# Altium project pinout_board_ver1.PrjPcb
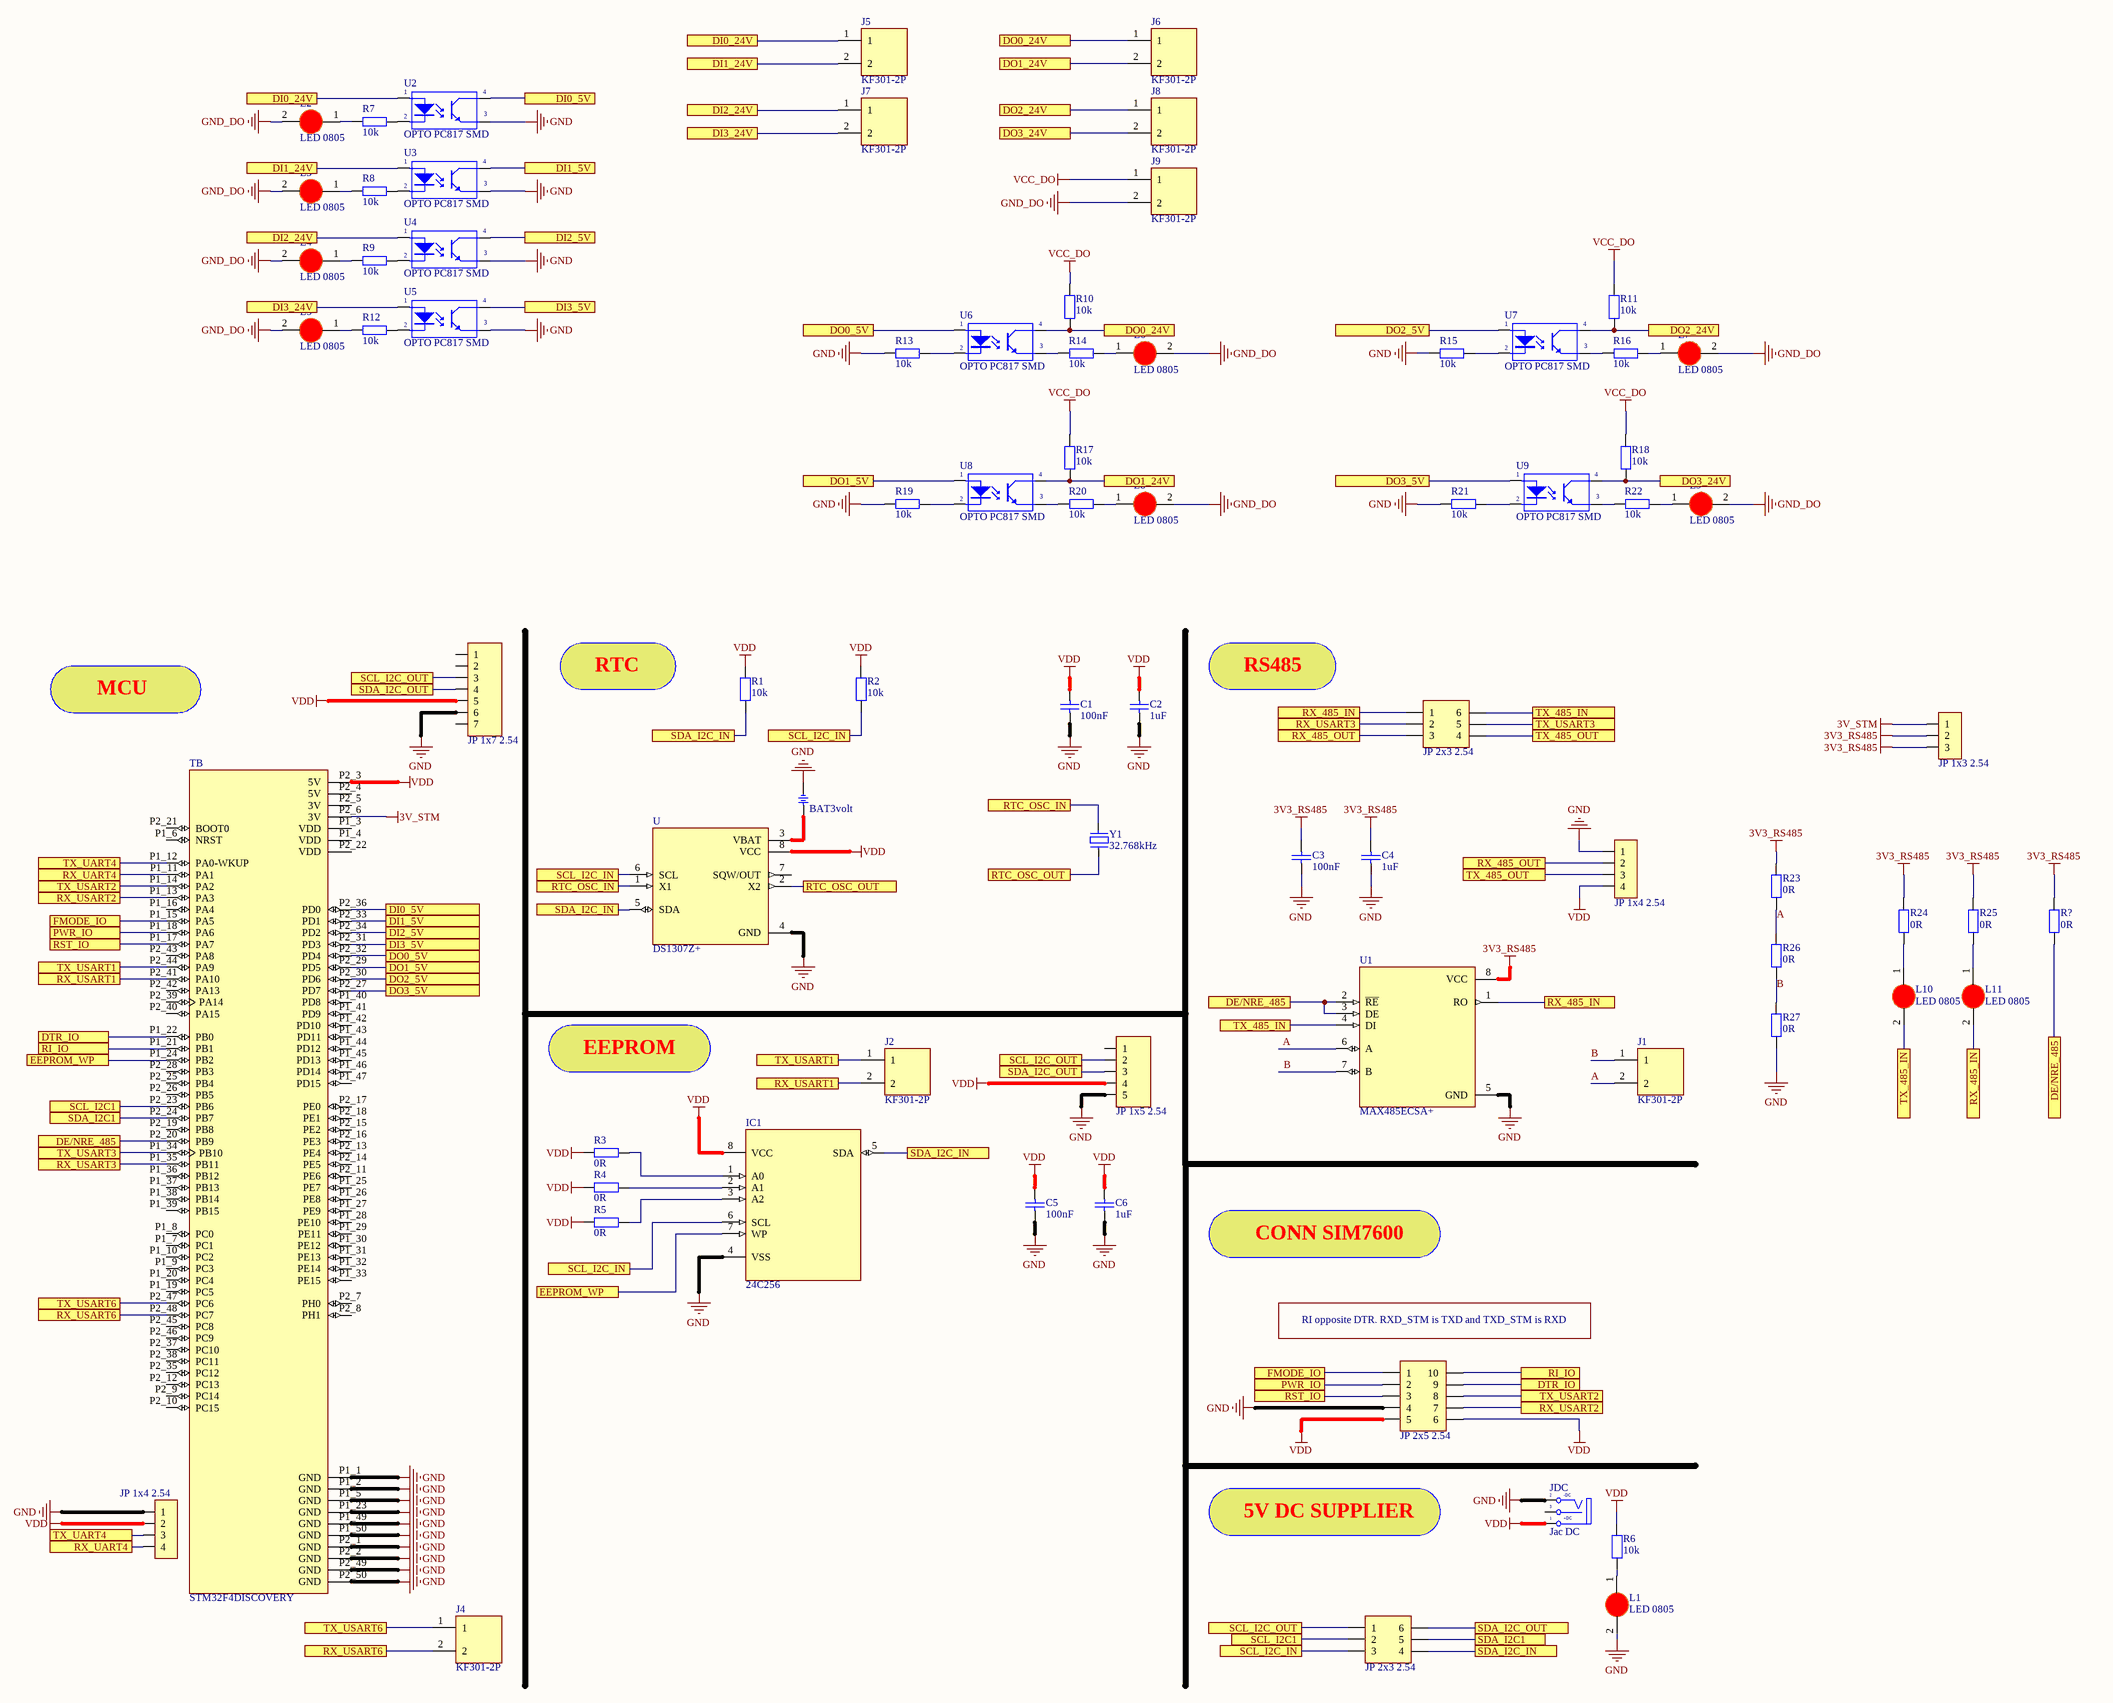
[diagram p0: Sch_pinout_board.SchDoc]
1 sheet, 76 parts. Net scope: flat (ports and power ports of the same name join across sheets).
Board file: PCB_pinout_board.PcbDoc

## Sheet Sch_pinout_board.SchDoc
size C; Organization: Altium Limited; Address1: L3, 12a Rodborough Rd; Address2: Frenchs Forest; Address3: NSW; Address4: Australia 2086

### Parts
BT1  BAT3volt  [BTH2032]
C1  100nF  [tu 0805]
C2  1uF  [tu 0805]
C3  100nF  [tu 0805]
C4  1uF  [tu 0805]
C5  100nF  [tu 0805]
C6  1uF  [tu 0805]
IC1  24C256  [SOIC127P600X175-8N]
J1  KF301-2P  [HANDSON_KF301-2P]
J2  KF301-2P  [HANDSON_KF301-2P]
J4  KF301-2P  [HANDSON_KF301-2P]
J5  KF301-2P  [HANDSON_KF301-2P]
J6  KF301-2P  [HANDSON_KF301-2P]
J7  KF301-2P  [HANDSON_KF301-2P]
J8  KF301-2P  [HANDSON_KF301-2P]
J9  KF301-2P  [HANDSON_KF301-2P]
JDC  Jac DC  [DC-IN]
JP1  JP 2x3 2.54  [JP 2x3 DT]
JP2  JP 1x4 2.54  [JP 1x4 CT]
JP3  JP 2x5 2.54  [JP 2x5 CT]
JP4  JP 1x7 2.54  [JP 1x7 CT]
JP5  JP 1x5 2.54  [JP 1x5 CT]
JP6  JP 2x3 2.54  [JP 2x3 DT]
JP50  JP 1x4 2.54  [JP 1x4 DT]
JP?  JP 1x3 2.54  [JP 1x3 DT]
L1  LED 0805  [LED-0805-Red]
L2  LED 0805  [LED-0805-Red]
L3  LED 0805  [LED-0805-Red]
L4  LED 0805  [LED-0805-Red]
L5  LED 0805  [LED-0805-Red]
L6  LED 0805  [LED-0805-Red]
L7  LED 0805  [LED-0805-Red]
L8  LED 0805  [LED-0805-Red]
L9  LED 0805  [LED-0805-Red]
L10  LED 0805  [LED-0805-Red]
L11  LED 0805  [LED-0805-Red]
R1  10k  [tro smd 0805]
R2  10k  [tro smd 0805]
R3  0R  [tro smd 0805]
R4  0R  [tro smd 0805]
R5  0R  [tro smd 0805]
R6  10k  [tro smd 0805]
R7  10k  [tro smd 0805]
R8  10k  [tro smd 0805]
R9  10k  [tro smd 0805]
R10  10k  [tro smd 0805]
R11  10k  [tro smd 0805]
R12  10k  [tro smd 0805]
R13  10k  [tro smd 0805]
R14  10k  [tro smd 0805]
R15  10k  [tro smd 0805]
R16  10k  [tro smd 0805]
R17  10k  [tro smd 0805]
R18  10k  [tro smd 0805]
R19  10k  [tro smd 0805]
R20  10k  [tro smd 0805]
R21  10k  [tro smd 0805]
R22  10k  [tro smd 0805]
R23  0R  [tro smd 0805]
R24  0R  [tro smd 0805]
R25  0R  [tro smd 0805]
R26  0R  [tro smd 0805]
R27  0R  [tro smd 0805]
R?  0R  [tro smd 0805]
TB  STM32F4DISCOVERY  [MODULE_STM32F4DISCOVERY]
U  DS1307Z+  [SOIC127P600X175-8N]
U1  MAX485ECSA+  [SOIC127P600X175-8N]
U2  OPTO PC817 SMD  [SOP4]
U3  OPTO PC817 SMD  [SOP4]
U4  OPTO PC817 SMD  [SOP4]
U5  OPTO PC817 SMD  [SOP4]
U6  OPTO PC817 SMD  [SOP4]
U7  OPTO PC817 SMD  [SOP4]
U8  OPTO PC817 SMD  [SOP4]
U9  OPTO PC817 SMD  [SOP4]
Y1  32.768kHz  [Thach Anh 2 Chan 32,768 KHz]

### Ports
DE/NRE_485, DI0_5V, DI0_24V, DI1_5V, DI1_24V, DI2_5V, DI2_24V, DI3_5V, DI3_24V, DO0_5V, DO0_24V, DO1_5V, DO1_24V, DO2_5V, DO2_24V, DO3_5V, DO3_24V, DTR_IO, EEPROM_WP, FMODE_IO, PWR_IO, RI_IO, RST_IO, RTC_OSC_IN, RTC_OSC_OUT, RX_485_IN, RX_485_OUT, RX_UART4, RX_USART1, RX_USART2, RX_USART3, RX_USART6, SCL_I2C1, SCL_I2C_IN, SCL_I2C_OUT, SDA_I2C1, SDA_I2C_IN, SDA_I2C_OUT, TX_485_IN, TX_485_OUT, TX_UART4, TX_USART1, TX_USART2, TX_USART3, TX_USART6

### Nets
3V3_RS485: C3.1 C4.1 JP?.2 JP?.3 R23.2 R24.2 R25.2 R?.2 U1.8(VCC)
3V_STM: JP?.1 TB.P2_6(3V)
GND: BT1.2 C1.2 C2.2 C3.2 C4.2 C5.2 C6.2 IC1.4(VSS) JDC.2(TN) JP2.1 JP3.4 JP4.6 JP5.5 JP50.1 L1.2(K) R13.1 R15.1 R19.1 R21.1 R27.1 TB.P1_1(GND) TB.P1_2(GND) TB.P1_5(GND) TB.P1_23(GND) TB.P1_49(GND) TB.P1_50(GND) TB.P2_1(GND) TB.P2_2(GND) TB.P2_49(GND) TB.P2_50(GND) U.4(GND) U1.5(GND) U2.3(E) U3.3(E) U4.3(E) U5.3(E)
GND_DO: J9.2 L2.2(K) L3.2(K) L4.2(K) L5.2(K) L6.2(K) L7.2(K) L8.2(K) L9.2(K)
VCC_DO: J9.1 R10.2 R11.2 R17.2 R18.2
VDD: C1.1 C2.1 C5.1 C6.1 IC1.8(VCC) JDC.1(T) JP2.4 JP3.5 JP3.6 JP4.5 JP5.4 JP50.2 R1.1 R2.1 R3.1 R4.1 R5.1 R6.1 TB.P2_3(5V) U.8(VCC)
A: J1.2 R23.1 R26.2 U1.6(A)
B: J1.1 R26.1 R27.2 U1.7(B)
NetBT1_1: BT1.1 U.3(VBAT)
NetIC1_1: IC1.1(A0) R3.2
NetIC1_2: IC1.2(A1) R4.2
NetIC1_3: IC1.3(A2) R5.2
NetIC1_5: IC1.5(SDA) JP6.4 R1.2 U.5(SDA) ; port SDA_I2C_IN
NetIC1_6: IC1.6(SCL) JP6.3 R2.2 U.6(SCL) ; port SCL_I2C_IN
NetIC1_7: IC1.7(WP) TB.P1_24(PB2) ; port EEPROM_WP
NetJ2_1: J2.1 TB.P2_44(PA9) ; port TX_USART1
NetJ2_2: J2.2 TB.P2_41(PA10) ; port RX_USART1
NetJ4_1: J4.1 TB.P2_47(PC6) ; port TX_USART6
NetJ4_2: J4.2 TB.P2_48(PC7) ; port RX_USART6
NetJ5_1: J5.1 U2.1(A) ; port DI0_24V
NetJ5_2: J5.2 U3.1(A) ; port DI1_24V
NetJ6_1: J6.1 R10.1 U6.4(C) ; port DO0_24V
NetJ6_2: J6.2 R17.1 U8.4(C) ; port DO1_24V
NetJ7_1: J7.1 U4.1(A) ; port DI2_24V
NetJ7_2: J7.2 U5.1(A) ; port DI3_24V
NetJ8_1: J8.1 R11.1 U7.4(C) ; port DO2_24V
NetJ8_2: J8.2 R18.1 U9.4(C) ; port DO3_24V
NetJP1_1: JP1.1 L11.2(K) U1.1(RO) ; port RX_485_IN
NetJP1_2: JP1.2 TB.P1_35(PB11) ; port RX_USART3
NetJP1_3: JP1.3 JP2.2 ; port RX_485_OUT
NetJP1_4: JP1.4 JP2.3 ; port TX_485_OUT
NetJP1_5: JP1.5 TB.P1_34(PB10) ; port TX_USART3
NetJP1_6: JP1.6 L10.2(K) U1.4(DI) ; port TX_485_IN
NetJP3_1: JP3.1 TB.P1_15(PA5) ; port FMODE_IO
NetJP3_2: JP3.2 TB.P1_18(PA6) ; port PWR_IO
NetJP3_3: JP3.3 TB.P1_17(PA7) ; port RST_IO
NetJP3_7: JP3.7 TB.P1_13(PA3) ; port RX_USART2
NetJP3_8: JP3.8 TB.P1_14(PA2) ; port TX_USART2
NetJP3_9: JP3.9 TB.P1_22(PB0) ; port DTR_IO
NetJP3_10: JP3.10 TB.P1_21(PB1) ; port RI_IO
NetJP4_3: JP4.3 JP5.2 JP6.1 ; port SCL_I2C_OUT
NetJP4_4: JP4.4 JP5.3 JP6.6 ; port SDA_I2C_OUT
NetJP6_2: JP6.2 TB.P2_23(PB6) ; port SCL_I2C1
NetJP6_5: JP6.5 TB.P2_24(PB7) ; port SDA_I2C1
NetJP50_3: JP50.3 TB.P1_12(PA0-WKUP) ; port TX_UART4
NetJP50_4: JP50.4 TB.P1_11(PA1) ; port RX_UART4
NetL1_1: L1.1(A) R6.2
NetL2_1: L2.1(A) R7.1
NetL3_1: L3.1(A) R8.1
NetL4_1: L4.1(A) R9.1
NetL5_1: L5.1(A) R12.2
NetL6_1: L6.1(A) R14.2
NetL7_1: L7.1(A) R16.2
NetL8_1: L8.1(A) R20.2
NetL9_1: L9.1(A) R22.2
NetL10_1: L10.1(A) R24.1
NetL11_1: L11.1(A) R25.1
NetR7_2: R7.2 U2.2(K)
NetR8_2: R8.2 U3.2(K)
NetR9_2: R9.2 U4.2(K)
NetR12_1: R12.1 U5.2(K)
NetR13_2: R13.2 U6.2(K)
NetR14_1: R14.1 U6.3(E)
NetR15_2: R15.2 U7.2(K)
NetR16_1: R16.1 U7.3(E)
NetR19_2: R19.2 U8.2(K)
NetR20_1: R20.1 U8.3(E)
NetR21_2: R21.2 U9.2(K)
NetR22_1: R22.1 U9.3(E)
NetR?_1: R?.1 TB.P2_20(PB9) U1.2(~{RE}) U1.3(DE) ; port DE/NRE_485
NetTB_P2_27: TB.P2_27(PD7) U9.1(A) ; port DO3_5V
NetTB_P2_29: TB.P2_29(PD5) U8.1(A) ; port DO1_5V
NetTB_P2_30: TB.P2_30(PD6) U7.1(A) ; port DO2_5V
NetTB_P2_31: TB.P2_31(PD3) U5.4(C) ; port DI3_5V
NetTB_P2_32: TB.P2_32(PD4) U6.1(A) ; port DO0_5V
NetTB_P2_33: TB.P2_33(PD1) U3.4(C) ; port DI1_5V
NetTB_P2_34: TB.P2_34(PD2) U4.4(C) ; port DI2_5V
NetTB_P2_36: TB.P2_36(PD0) U2.4(C) ; port DI0_5V
NetU_1: U.1(X1) Y1.2 ; port RTC_OSC_IN
NetU_2: U.2(X2) Y1.1 ; port RTC_OSC_OUT

Not connected (* = marked no-connect by the designer): JDC 3(S); JP4 1 2 7; JP5 1; TB P1_3(VDD) P1_4(VDD) P1_6(NRST) P1_7(PC1) P1_8(PC0) P1_9(PC3) P1_10(PC2) P1_16(PA4) P1_19(PC5) P1_20(PC4) P1_25(PE7) P1_26(PE8) P1_27(PE9) P1_28(PE10) P1_29(PE11) P1_30(PE12) P1_31(PE13) P1_32(PE14) P1_33(PE15) P1_36(PB12) P1_37(PB13) P1_38(PB14) P1_39(PB15) P1_40(PD8) P1_41(PD9) P1_42(PD10) P1_43(PD11) P1_44(PD12) P1_45(PD13) P1_46(PD14) P1_47(PD15) P2_4(5V) P2_5(3V) P2_7(PH0) P2_8(PH1) P2_9(PC14) P2_10(PC15) P2_11(PE6) P2_12(PC13) P2_13(PE4) P2_14(PE5) P2_15(PE2) P2_16(PE3) P2_17(PE0) P2_18(PE1) P2_19(PB8) P2_21(BOOT0) P2_22(VDD) P2_25(PB4) P2_26(PB5) P2_28(PB3) P2_35(PC12) P2_37(PC10) P2_38(PC11) P2_39(PA14) P2_40(PA15) P2_42(PA13) P2_43(PA8) P2_45(PC8) P2_46(PC9); U 7(SQW/OUT)

### Notes on the sheet
- RTC
- RS485
- MCU
- EEPROM
- CONN SIM7600
- RI opposite DTR. RXD_STM is TXD and TXD_STM is RXD
- 5V DC SUPPLIER
- Title
- Size:
- Date:
- A4
- Number:
- Time:
- Revision:
- Sheet
- of
- File:
- (in symbol DCIN) -DC; +DC

### Library data of the parts
BT1 = BATH_CR2032: BATTERY HOLDER, CR2032; VALUE: BAT3volt; MANF_P#: -; .: http://www.chila.ir
C1 C3 C5 = Tu 0805 105 50V 10%: Dán; Don_Vi: Con; So_Chan: 2; Ten_Linh_Kien: Tụ 0805 105-1uF 10% 50V; Ma_Hang: MH004552; Chung_Loai: Dán; Kieu_Chan: *
C2 C4 C6 = Tu 0805 10pF 50V 10%: Dán; Don_Vi: Con; So_Chan: 2; Ten_Linh_Kien: Tụ 0805 10P 10% 50V; Ma_Hang: MH004554; Chung_Loai: Dán; Kieu_Chan: *
IC1 = 24LC256-I/SN: EEPROM Memory IC 256Kb _32K x 8_ IÂ²C 400kHz 900ns 8-SOIC; MF: Microchip; Value: *; MP: 24LC256-I/SN; Package: SOIC-8 Microchip; SnapEDA_Link: https://www.snapeda.com/parts/24LC256-I/SN/Microchip/view-part/9771/?ref=snap; Price: None; Availability: Unavailable
J1 J2 J4-J9 = KF301-2P: 2 Pin Terminal Block 5mm Pitch; MF: Handson Technology; Availability: Unavailable; MP: KF301-2P; Price: None; Value: *; SnapEDA_Link: https://www.snapeda.com/parts/KF301-2P/Handson%20Technology/view-part/4276957/?ref=snap; Package: Package
JDC = DCIN: Jac DC input; Value: Jac DC
JP1 JP6 = JP 2x3 2.54 Duc Thang: Cắm; Ten_Linh_Kien: Jump Đôi Đực 2.54MM 2x40P Thẳng 11MM; Don_Vi: Con; Ma_Hang: MH002686; Ghi_Chu: *; Kieu_Chan: *; Chung_Loai: Cắm
JP2 = JP 1x4 2.54 Cai Thang: Cắm; Ten_Linh_Kien: Jump Đơn Cái 2.54MM 1x20P Thẳng; Don_Vi: Con; Ma_Hang: MH004006; Ghi_Chu: *; Kieu_Chan: *; Chung_Loai: Cắm
JP3 = JP 2x5 2.54 Cai Thang: Cắm; Ten_Linh_Kien: Jump Đôi Cái 2.54MM 2x20P Thẳng; Don_Vi: Con; Ma_Hang: MH008647; Ghi_Chu: *; Kieu_Chan: *; Chung_Loai: Cắm
JP4 = JP 1x7 2.54 Cai Thang: Cắm; Ten_Linh_Kien: Jump Đơn Cái 2.54MM 1x20P Thẳng; Don_Vi: Con; Ma_Hang: MH004006; Ghi_Chu: *; Kieu_Chan: *; Chung_Loai: Cắm
JP5 = JP 1x5 2.54 Cai Thang: Cắm; Ten_Linh_Kien: Jump Đơn Cái 2.54MM 1x20P Thẳng; Don_Vi: Con; Ma_Hang: MH004006; Ghi_Chu: *; Kieu_Chan: *; Chung_Loai: Cắm
JP50 = JP 1x4 2.54 Duc Thang: Cắm; Ten_Linh_Kien: Jump Đơn Đực 2.54MM 1x40P Thẳng 11MM; Don_Vi: Con; Ma_Hang: MH000903; Ghi_Chu: *; Kieu_Chan: *; Chung_Loai: Cắm
JP? = JP 1x3 2.54 Duc Thang: Cắm; Ten_Linh_Kien: Jump Đơn Đực 2.54MM 1x40P Thẳng 11MM; Don_Vi: Con; Ma_Hang: MH000903; Ghi_Chu: *; Kieu_Chan: *; Chung_Loai: Cắm
L1-L11 = LED 0805 Do: Dán; Don_Vi: Con; Ma_Hang: MH000897; Ten_Linh_Kien: LED 0805 Màu Đỏ (Red); Ghi_Chu: *; Kieu_Chan: *; Chung_Loai: Dán
R1-R27 R? = Tro 0805 1% 1k: Dán; Don_Vi: Con; So_Chan: 2; Ten_Linh_Kien: Trở 0805 1% 1k; Ma_Hang: MH005468; Chung_Loai: Dán; Kieu_Chan: *
TB = STM32F4DISCOVERY: STM32F407VGT6 Discovery STM32F4 ARMÂ® CortexÂ®-M4 MCU 32-Bit Embedded Evaluation Board; MF: STMicroelectronics; MP: STM32F4DISCOVERY; Package: None; Price: None; Availability: Unavailable; Value: *; SnapEDA_Link: https://www.snapeda.com/parts/STM32F4DISCOVERY/STMicroelectronics/view-part/46335/?ref=snap
U = DS1307Z+: Real Time Clock _RTC_ IC Clock/Calendar 56B IÂ²C, 2-Wire Serial 8-SOIC _0.154, 3.90mm Width_; MF: Maxim Integrated; Availability: Unavailable; SnapEDA_Link: https://www.snapeda.com/parts/DS1307Z/Maxim%20Integrated/view-part/524266/?ref=snap; Price: None; Package: SO-8 Maxim Integrated; MP: DS1307Z; Value: *
U1 = MAX485ECSA+: 1/1 Transceiver Half RS422, RS485 8-SOIC; MF: Maxim Integrated; Package: SOIC-8 Maxim Integrated; MP: MAX485ECSA; Value: *; SnapEDA_Link: https://www.snapeda.com/parts/MAX485ECSA/Maxim%20Integrated/view-part/978440/?ref=snap; Price: None; Availability: Unavailable
U2-U9 = OPTO PC817 SMD: Single Opto; Value: PC817
Y1 = Thach Anh 2 chan 32,768 Khz: Crystal For all Crystal 2pin.; Value: 4Mhz